# EAGLE design honda_type1 (EAGLE 8.3.2)

## Sheet 1 of 2
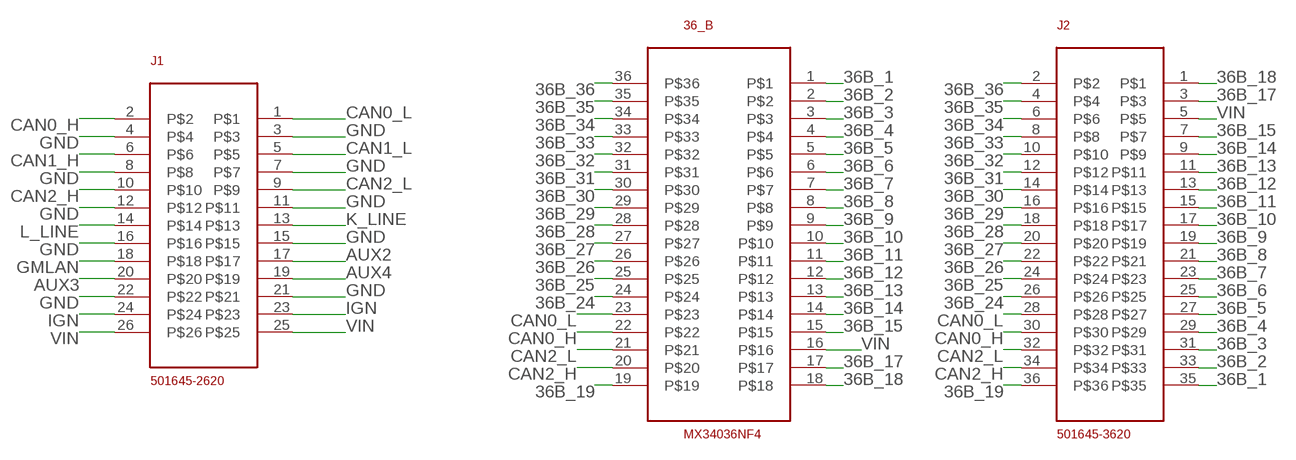
[diagram p0: schematic, sheet 1]

### Parts
36_B  MX34036NF4  [MX34036NF2]
J1  501645-2620  [501645-2620]
J2  501645-3620  [501645-3620]

### Nets
36B_1: 36_B.1 J2.35
36B_2: 36_B.2 J2.33
36B_3: 36_B.3 J2.31
36B_4: 36_B.4 J2.29
36B_5: 36_B.5 J2.27
36B_6: 36_B.6 J2.25
36B_7: 36_B.7 J2.23
36B_8: 36_B.8 J2.21
36B_9: 36_B.9 J2.19
36B_10: 36_B.10 J2.17
36B_11: 36_B.11 J2.15
36B_12: 36_B.12 J2.13
36B_13: 36_B.13 J2.11
36B_14: 36_B.14 J2.9
36B_15: 36_B.15 J2.7
36B_17 [PWR]: 36_B.17 J2.3
36B_18: 36_B.18 J2.1
36B_19: 36_B.19 J2.36
36B_24: 36_B.24 J2.26
36B_25: 36_B.25 J2.24
36B_26: 36_B.26 J2.22
36B_27: 36_B.27 J2.20
36B_28: 36_B.28 J2.18
36B_29: 36_B.29 J2.16
36B_30: 36_B.30 J2.14
36B_31: 36_B.31 J2.12
36B_32: 36_B.32 J2.10
36B_33: 36_B.33 J2.8
36B_34 [PWR]: 36_B.34 J2.6
36B_35: 36_B.35 J2.4
36B_36: 36_B.36 J2.2
AUX2: J1.17
AUX3: J1.20
AUX4: J1.19
CAN0_H: 36_B.22 J1.2 J2.30
CAN0_L: 36_B.23 J1.1 J2.28
CAN1_H: J1.6
CAN1_L: J1.5
CAN2_H: 36_B.20 J1.10 J2.34
CAN2_L: 36_B.21 J1.9 J2.32
GMLAN: J1.18
GND: J1.3 J1.4 J1.7 J1.8 J1.11 J1.12 J1.15 J1.16 J1.21 J1.22
IGN [PWR]: J1.23 J1.24
K_LINE: J1.13
L_LINE: J1.14
VIN [PWR]: 36_B.16 J1.25 J1.26 J2.5

## Sheet 2 of 2

## Library data of the parts
36_B = Souers:MX34036NF4
J1 = Souers:501645-2620
J2 = Souers:501645-3620

## Net classes
1 PWR: width 0.813 mm, clearance 0.127 mm

## Board
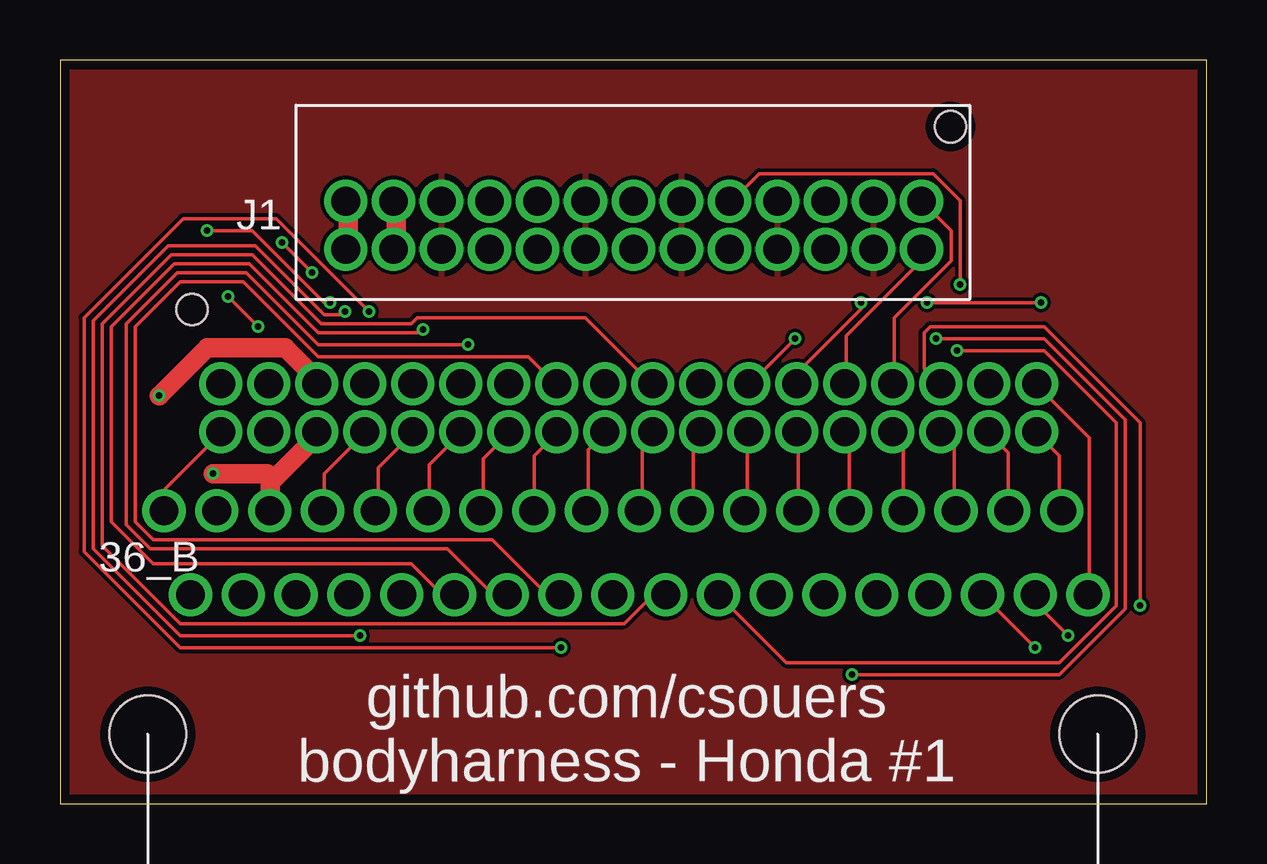
[diagram p1: board, top side]
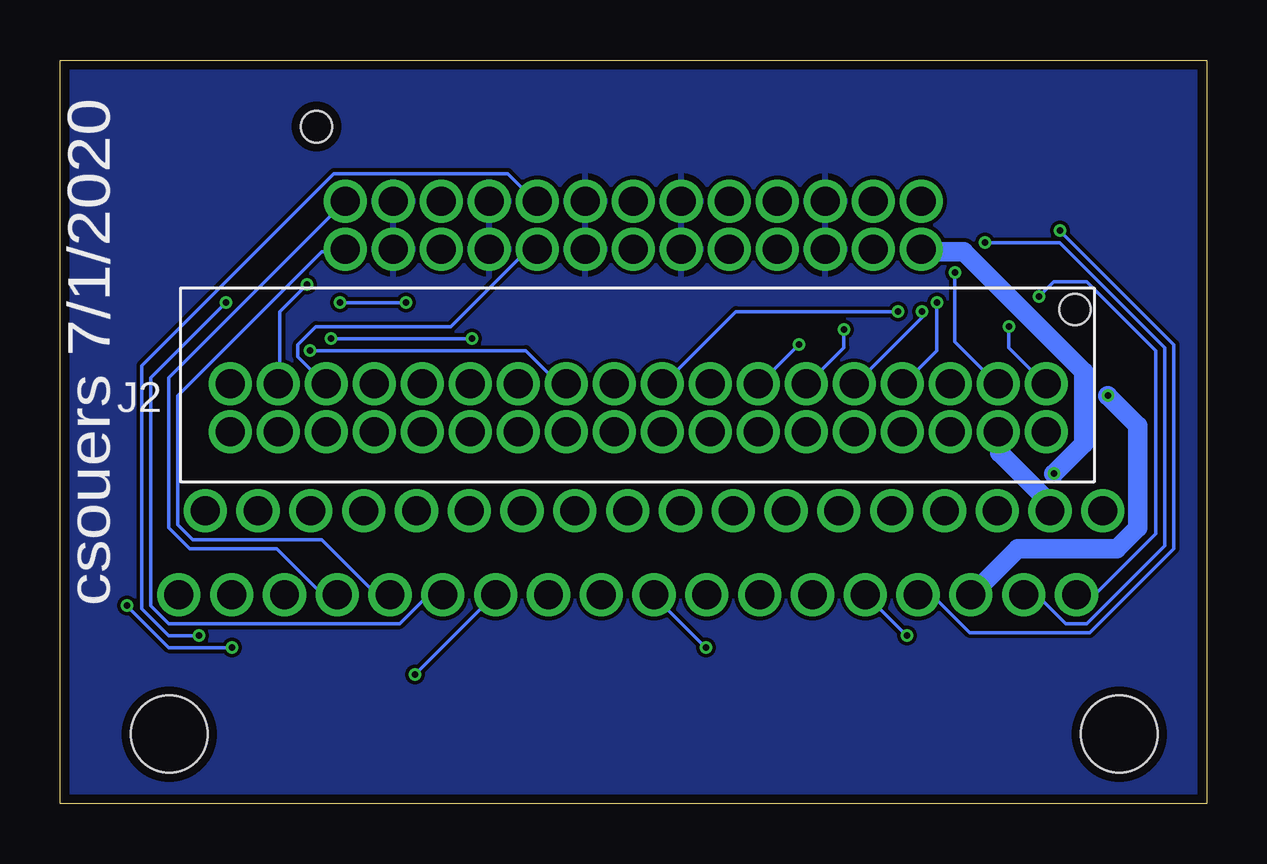
[diagram p2: board, bottom side, seen from below]

Size 47.79 x 30.98 mm. Coordinates in mm from the lower left corner, seen from the top.
Outline: 0,0 47.79,0 47.79,30.98 0,30.98 0,0
Copper layers (1*16): Top 0.035559375mm / dielectric 1.6mm / Bottom 0.035559375mm
Design rules "default *": minimum track width 6mil, minimum drill 10mil, track to track 6mil, track to pad 6mil, pad to pad 6mil, via to via 6mil, smd to smd 6mil, copper to edge 15mil, drill to drill 6mil, minimum pad ring 5mil, minimum via ring 5mil, stop-mask expansion 2.5mil, vias tented up to drill 0mil, thermal gap 10mil

### Footprints (pad centres in the part's own frame; a part is rotated, then mirrored left to right if it is on the bottom)
MX34036NF2 = drill 1.2: 1 19.8,0; 2 17.6,0; 3 15.4,0; 4 13.2,0; 5 11,0; 6 8.8,0; 7 6.6,0; 8 4.4,0; 9 2.2,0; 10 0,0; 11 -2.2,0; 12 -4.4,0; 13 -6.6,0; 14 -8.8,0; 15 -11,0; 16 -13.2,0; 17 -15.4,0; 18 -17.6,0; 19 20.9,-3.5; 20 18.7,-3.5; 21 16.5,-3.5; 22 14.3,-3.5; 23 12.1,-3.5; 24 9.9,-3.5; 25 7.7,-3.5; 26 5.5,-3.5; 27 3.3,-3.5; 28 1.1,-3.5; 29 -1.1,-3.5; 30 -3.3,-3.5; 31 -5.5,-3.5; 32 -7.7,-3.5; 33 -9.9,-3.5; 34 -12.1,-3.5; 35 -14.3,-3.5; 36 -16.5,-3.5 | hole 3.2: 21.3,-9.3; -18.282,-9.3
501645-2620 = drill 1.2: 1 -20,1; 2 -20,-1; 3 -18,1; 4 -18,-1; 5 -16,1; 6 -16,-1; 7 -14,1; 8 -14,-1; 9 -12,1; 10 -12,-1; 11 -10,1; 12 -10,-1; 13 -8,1; 14 -8,-1; 15 -6,1; 16 -6,-1; 17 -4,1; 18 -4,-1; 19 -2,1; 20 -2,-1; 21 0,1; 22 0,-1; 23 2,1; 24 2,-1; 25 4,1; 26 4,-1 | hole 1.3: -21.2,-4.1
501645-3620 = drill 1.2: 1 -20,1; 2 -20,-1; 3 -18,1; 4 -18,-1; 5 -16,1; 6 -16,-1; 7 -14,1; 8 -14,-1; 9 -12,1; 10 -12,-1; 11 -10,1; 12 -10,-1; 13 -8,1; 14 -8,-1; 15 -6,1; 16 -6,-1; 17 -4,1; 18 -4,-1; 19 -2,1; 20 -2,-1; 21 0,1; 22 0,-1; 23 2,1; 24 2,-1; 25 4,1; 26 4,-1; 27 6,1; 28 6,-1; 29 8,1; 30 8,-1; 31 10,1; 32 10,-1; 33 12,1; 34 12,-1; 35 14,1; 36 14,-1 | hole 1.3: -21.2,-4.1

### Placement (x,y rotation side)
36_B  21.94,12.19 0 top
J1  15.9,24.1 180 top
J2  26.7,16.49 180 bottom

### Tracks (layer width: path | path; a pad name or v marks a point on that pad's centre or on a via)
36B_1
  Top 0.152: 36_B.1 41.62,12.25 41.62,14.5 40.75,15.38 J2.35
36B_2
  Top 0.152: 36_B.2 39.5,12.25 39.5,14.62 38.75,15.38 J2.33
36B_3
  Top 0.152: 36_B.3 37.25,12.25 37.25,14.88 36.75,15.38 J2.31
36B_4
  Top 0.152: 36_B.4 35.12,12.25 35.12,15 34.75,15.38 J2.29
36B_5
  Top 0.152: 36_B.5 32.88,12.25 32.88,15.25 32.75,15.38 J2.27
36B_6
  Top 0.152: 36_B.6 30.75,12.25 30.75,15.38 J2.25
36B_7
  Top 0.152: 36_B.7 28.62,12.25 28.62,15.38 J2.23
36B_8
  Top 0.152: 36_B.8 26.38,12.25 26.38,15.12 26.62,15.38 J2.21
36B_9
  Top 0.152: 36_B.9 24.25,12.25 24.25,15 24.62,15.38 J2.19
36B_10
  Top 0.152: 36_B.10 22,12.25 22,14.75 22.62,15.38 J2.17
36B_11
  Top 0.152: 36_B.11 19.75,12.25 19.75,14.5 20.62,15.38 J2.15
36B_12
  Top 0.152: 36_B.12 17.62,12.25 17.62,14.38 18.62,15.38 J2.13
36B_13
  Top 0.152: 36_B.13 15.38,12.25 15.38,14.12 16.62,15.38 J2.11
36B_14
  Top 0.152: 36_B.14 13.25,12.25 13.25,14 14.62,15.38 J2.9
36B_15
  Top 0.152: 36_B.15 11,12.25 11,13.75 12.62,15.38 J2.7
36B_17
  Bottom 0.813: 36_B.17 6.62,12.25 6.62,12.62 8.62,14.62 8.62,15.38 J2.3
36B_18
  Top 0.152: 36_B.18 4.38,12.25 4.38,13.12 6.62,15.38 J2.1
36B_19
  Top 0.152: 36_B.19 42.88,8.75 42.88,15.25 40.75,17.38 J2.36
36B_24  (via drill 0.25)
  Top 0.152: v36.12,20.88 v40.88,20.88 | v33.38,20.88 33.38,20.62 30.75,18 30.75,17.5 J2.26
  Bottom 0.152: v40.88,20.88 44,17.75 44,8.25 43.25,7.5 33.62,7.5 32.5,8.62 31.88,8.62 36_B.24 | v33.38,20.88 v36.12,20.88
36B_25  (via drill 0.25)
  Top 0.152: v33,5.38 41.62,5.38 44.38,8.12 44.38,16 41,19.38 v36.5,19.38 | v30.62,19.38 28.75,17.5 J2.24
  Bottom 0.152: v33,5.38 29.75,8.62 36_B.25 | v30.62,19.38 v36.5,19.38
36B_26  (via drill 0.25)
  Top 0.152: v37.38,18.88 41,18.88 44,15.88 44,8.25 41.62,5.88 30.25,5.88 27.5,8.62 36_B.26
  Bottom 0.152: v37.38,18.88 28.38,18.88 27,17.5 26.75,17.5 J2.22
36B_27
  Top 0.152: 36_B.27 25.12,8.62 24.62,8.62 23.5,7.5 5,7.5 1.75,10.75 1.75,20 4.62,22.88 8,22.88 10.88,20 14.62,20 14.88,20.25 21.88,20.25 24.62,17.5 J2.20
36B_28  (via drill 0.25)
  Top 0.152: v20.88,6.5 5,6.5 1,10.5 1,20.25 5.12,24.38 9,24.38 v12.88,20.5
  Bottom 0.152: v20.88,6.5 23,8.62 36_B.28 | v12.88,20.5 19.62,20.5 22.62,17.5 J2.18
36B_29
  Top 0.152: 36_B.29 20.75,8.75 20.25,8.75 18,11 3.88,11 3.12,11.75 3.12,19.88 5,21.75 7.62,21.75 10.75,18.62 19.5,18.62 20.62,17.5 J2.16
36B_30  (via drill 0.25)
  Top 0.152: v17,19.12 10.75,19.12 7.75,22.12 4.88,22.12 2.75,20 2.75,11.62 3.75,10.62 16.12,10.62 18,8.75 18.62,8.75 36_B.30
  Bottom 0.152: v17,19.12 18.62,17.5 J2.14
36B_31  (via drill 0.25)
  Top 0.152: v15.12,19.75 15,19.62 10.75,19.62 7.88,22.5 4.75,22.5 2.12,19.88 2.12,11.75 3.88,10 14.62,10 15.88,8.75 16.38,8.75 36_B.31
  Bottom 0.152: v15.12,19.75 15.12,19 16.62,17.5 J2.12
36B_32  (via drill 0.25)
  Top 0.152: v12.5,7 5,7 1.38,10.62 1.38,20.12 4.5,23.25 8.12,23.25 11,20.38 11.75,20.38 v11.88,20.5
  Bottom 0.152: v12.5,7 14.12,8.62 36_B.32 | v11.88,20.5 11.88,20.25 14.62,17.5 J2.10
36B_33  (via drill 0.25)
  Top 0.152: v6.12,23.88 8,23.88 11,20.88 v11.25,20.88
  Bottom 0.152: v6.12,23.88 1.38,19.12 1.38,10.62 4.88,7.12 9.88,7.12 11.38,8.62 12,8.62 36_B.33 | v11.25,20.88 11.25,18.88 12.62,17.5 J2.8
36B_34  (via drill 0.25)
  Top 0.813: v4.12,17 6.12,19 9.38,19 10.62,17.75 10.62,17.5 J2.6
  Bottom 0.813: v4.12,17 2.88,15.75 2.88,11.5 3.75,10.62 7.88,10.62 9.75,8.75 36_B.34
36B_35  (via drill 0.25)
  Top 0.152: v10.5,22.12 v9.25,23.38
  Bottom 0.152: v9.25,23.38 6.12,23.38 1.75,19 1.75,10.75 5,7.5 5.88,7.5 7,8.62 7.62,8.62 36_B.35 | v10.5,22.12 10.5,19.25 8.75,17.5 J2.4
36B_36  (via drill 0.25)
  Top 0.152: v8.25,19.88 v7,21.12
  Bottom 0.152: v7,21.12 6.38,21.75 5,21.75 2.12,18.88 2.12,11.25 4.62,8.75 5.38,8.75 36_B.36 | v8.25,19.88 8.25,19 6.75,17.5 J2.2
CAN0_H
  Top 0.152: J1.2 37.12,23.88 37.12,22.62 34.75,20.25 34.75,17.5 J2.30
  Bottom 0.152: J1.2 43.25,17.75 43.25,11.5 42.38,10.62 38.75,10.62 36.88,8.75 36.25,8.75 36_B.22
CAN0_L
  Top 0.152: J2.28 32.75,17.5 32.75,19.5 35.88,22.62 35.88,23 J1.1
  Bottom 0.152: 36_B.23 34.12,8.75 34.62,8.75 36.88,11 42.25,11 42.88,11.62 42.88,17 36.88,23 36,23 J1.1
CAN2_H  (via drill 0.25)
  Top 0.152: v42,7 40.75,8.25 40.75,8.62 36_B.20 | v37.5,21.62 37.5,25.12 36.38,26.25 29.12,26.25 28,25.12 J1.10
  Bottom 0.152: v42,7 43.25,7 44.38,8.12 44.38,18.25 36.38,26.25 29.12,26.25 28,25.12 J1.10 | v37.5,21.62 38.62,20.5 38.62,17.5 J2.34
CAN2_L  (via drill 0.25)
  Top 0.152: v40.62,6.5 38.5,8.62 36_B.21 | v45,8.25 45,15.88 41,19.88 36.25,19.88 36,19.62 36,18.12 36.62,17.5 J2.32
  Bottom 0.152: J1.9 28,23 28.38,23 31.5,19.88 37.12,19.88 37.88,19.12 37.88,18.62 36.75,17.5 J2.32 | v40.62,6.5 43.25,6.5 v45,8.25
GND
  pour Bottom: 47.8,0 47.8,31 0,31 0,0
  pour Top: 0,31 0,0 47.8,0 47.8,31
IGN
  Top 0.813: J1.23 14,23.12 14,25 J1.24
VIN  (via drill 0.25)
  Top 0.813: J1.25 12,23.12 12,25 J1.26 | 8.75,13.38 8.75,12.25 36_B.16 | 8.75,13.38 10.75,15.38 J2.5 | v6.38,13.75 8.62,13.75 8.75,13.38
  Bottom 0.813: v6.38,13.75 5.12,15 5.12,18 10.12,23 11.88,23 J1.25

### Text on the board
tPlace: github.com/csouers / bodyharness - Honda #1
bPlace: csouers 7/1/2020